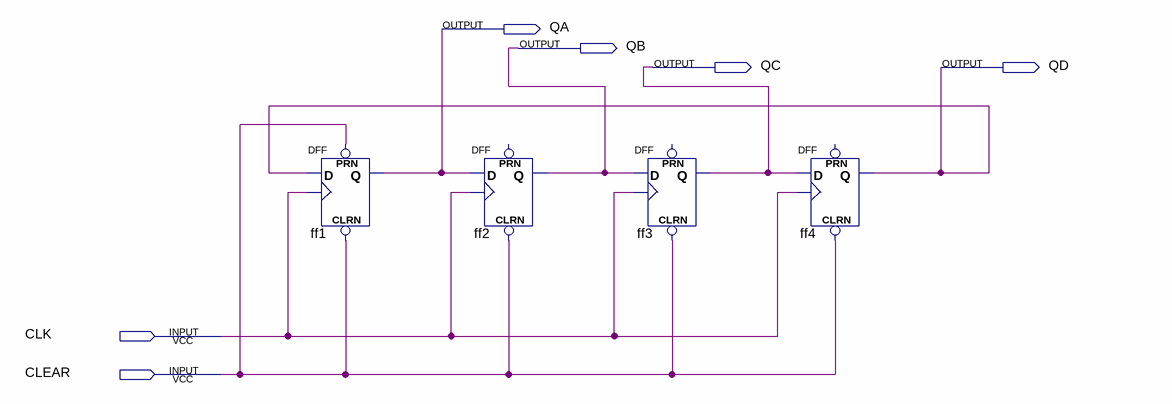
[diagram p0: schematic sheet]
// Quartus schematic REGANEL.bdf as structural Verilog: 4 symbols, 6 pins
module REGANEL (
  input  CLK,
  input  CLEAR,
  output QA,
  output QB,
  output QC,
  output QD
);

  DFF ff1 (.CLRN(CLEAR), .CLK(CLK), .D(QD), .PRN(CLEAR), .Q(QA));
  DFF ff2 (.CLRN(CLEAR), .CLK(CLK), .D(QA), .Q(QB));  // open: PRN
  DFF ff3 (.CLRN(CLEAR), .CLK(CLK), .D(QB), .Q(QC));  // open: PRN
  DFF ff4 (.CLRN(CLEAR), .CLK(CLK), .D(QC), .Q(QD));  // open: PRN
endmodule
